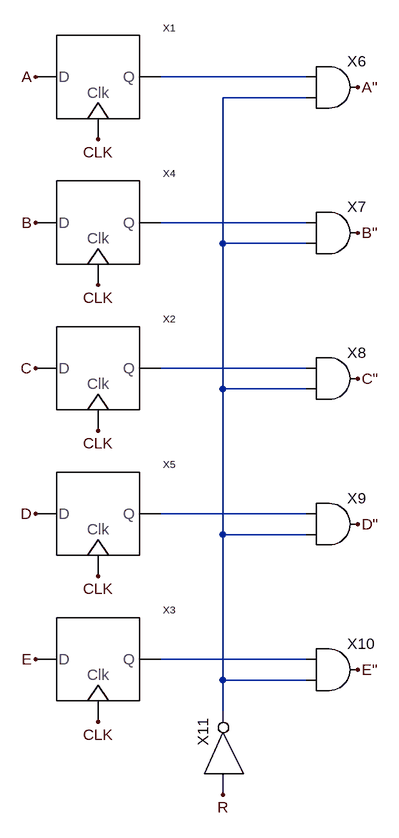
[diagram p0: schematic DFF_5.asc]
DFF_5.asc, the LTspice schematic file:
Version 4
SHEET 1 892 1192
WIRE 240 -112 16 -112
WIRE 240 -80 112 -80
WIRE 240 112 16 112
WIRE 112 144 112 -80
WIRE 240 144 112 144
WIRE 240 336 16 336
WIRE 112 368 112 144
WIRE 240 368 112 368
WIRE 240 560 16 560
WIRE 112 592 112 368
WIRE 240 592 112 592
WIRE 240 784 16 784
WIRE 112 816 112 592
WIRE 240 816 112 816
WIRE 112 864 112 816
FLAG -176 -112 A
FLAG -176 112 B
FLAG -176 336 C
FLAG -176 560 D
FLAG -176 784 E
FLAG 320 -96 A"
FLAG 320 128 B"
FLAG 320 352 C"
FLAG 320 576 D"
FLAG 320 800 E"
FLAG -80 -16 CLK
FLAG -80 208 CLK
FLAG -80 432 CLK
FLAG -80 656 CLK
FLAG -80 880 CLK
FLAG 112 992 R
SYMBOL D_FF -80 -112 R0
SYMATTR InstName X1
SYMBOL D_FF -80 336 R0
SYMATTR InstName X2
SYMBOL D_FF -80 784 R0
SYMATTR InstName X3
SYMBOL D_FF -80 112 R0
SYMATTR InstName X4
SYMBOL D_FF -80 560 R0
SYMATTR InstName X5
SYMBOL AND2 288 -160 R0
SYMATTR InstName X6
SYMBOL AND2 288 64 R0
SYMATTR InstName X7
SYMBOL AND2 288 288 R0
SYMATTR InstName X8
SYMBOL AND2 288 512 R0
SYMATTR InstName X9
SYMBOL AND2 288 736 R0
SYMATTR InstName X10
SYMBOL NOT 80 960 R270
SYMATTR InstName X11

The netlist it stands for:
* DFF_5.asc
XX1 A N001 CLK D_FF  ; pins D Q clock
XX2 C N004 CLK D_FF  ; pins D Q clock
XX3 E N006 CLK D_FF  ; pins D Q clock
XX4 B N003 CLK D_FF  ; pins D Q clock
XX5 D N005 CLK D_FF  ; pins D Q clock
XX6 N001 N002 A" AND2  ; pins In1 In2 Out
XX7 N003 N002 B" AND2  ; pins In1 In2 Out
XX8 N004 N002 C" AND2  ; pins In1 In2 Out
XX9 N005 N002 D" AND2  ; pins In1 In2 Out
XX10 N006 N002 E" AND2  ; pins In1 In2 Out
XX11 R N002 NOT  ; pins In Out
.backanno
.end